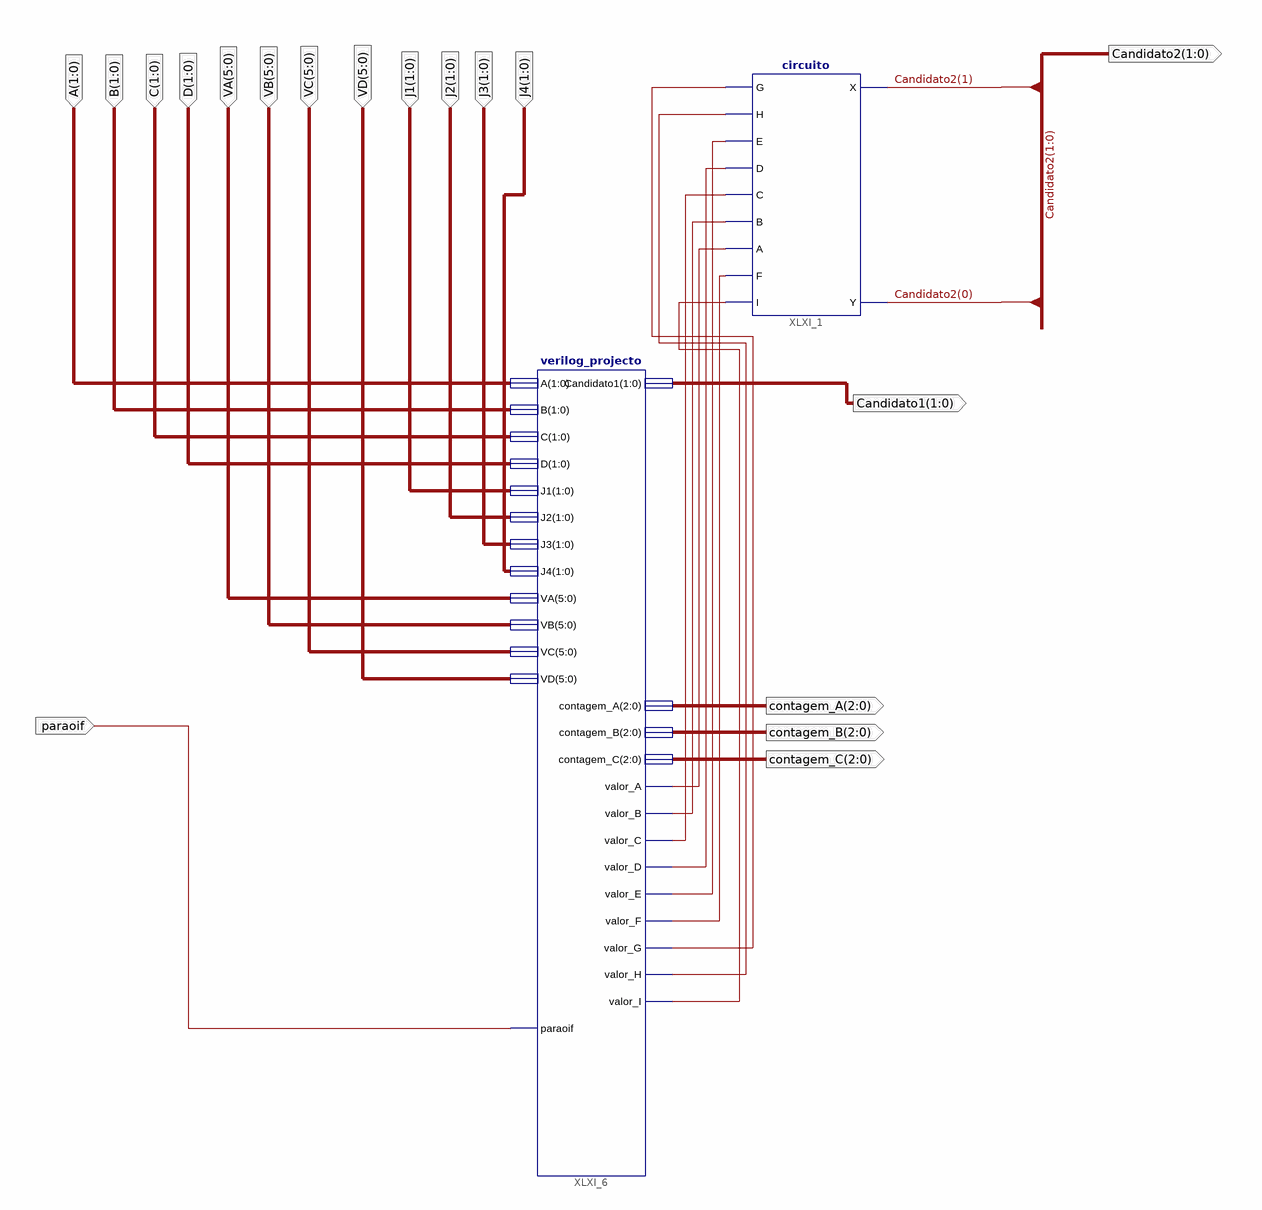
[diagram p0: schematic sheet 1]
// Xilinx ISE schematic codigojunto.sch (artix7) as structural Verilog: 2 symbols, 18 ports
module codigojunto (
  input  [1:0] A,
  input  [1:0] B,
  input  [1:0] C,
  input  [1:0] D,
  input  [5:0] VA,
  input  [5:0] VB,
  input  [5:0] VC,
  input  [5:0] VD,
  input  [1:0] J1,
  input  [1:0] J2,
  input  [1:0] J3,
  input  [1:0] J4,
  input  paraoif,
  output [1:0] Candidato1,
  output [2:0] contagem_A,
  output [2:0] contagem_B,
  output [2:0] contagem_C,
  output [1:0] Candidato2
);

  wire XLXN_2, XLXN_3, XLXN_4, XLXN_5, XLXN_6, XLXN_7, XLXN_8, XLXN_9, XLXN_10;

  circuito XLXI_1 (
    .G(XLXN_8), .H(XLXN_9), .E(XLXN_6), .D(XLXN_5), .C(XLXN_4), .B(XLXN_3), .A(XLXN_2), .F(XLXN_7),
    .I(XLXN_10), .X(Candidato2[1]), .Y(Candidato2[0]));
  verilog_projecto XLXI_6 (
    .paraoif(paraoif), .A(A), .B(B), .C(C), .D(D), .J1(J1), .J2(J2), .J3(J3), .J4(J4), .VA(VA), .VB(VB),
    .VC(VC), .VD(VD), .valor_A(XLXN_2), .valor_B(XLXN_3), .valor_C(XLXN_4), .valor_D(XLXN_5),
    .valor_E(XLXN_6), .valor_F(XLXN_7), .valor_G(XLXN_8), .valor_H(XLXN_9), .valor_I(XLXN_10),
    .Candidato1(Candidato1), .contagem_A(contagem_A), .contagem_B(contagem_B), .contagem_C(contagem_C));
endmodule
